# Altium schematic sheet Motor Driver.SchDoc
size A4; SheetNumber: 6; SheetTotal: 10
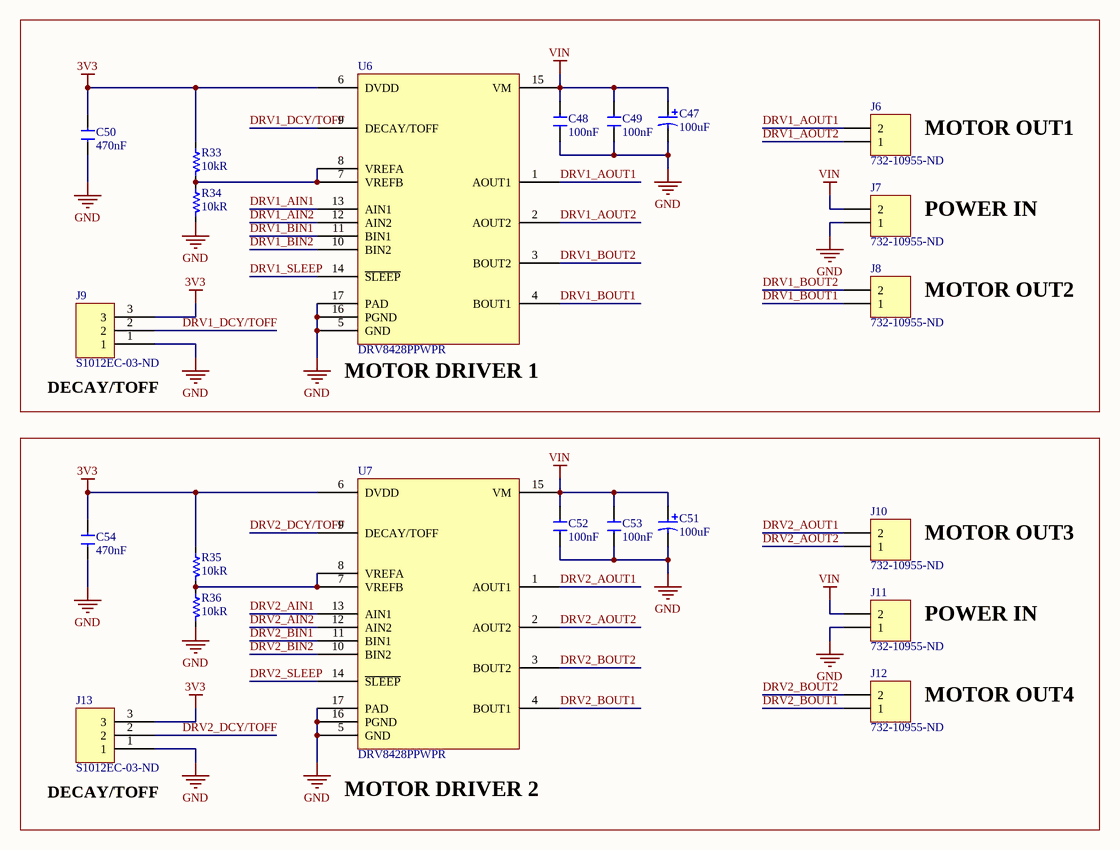
[diagram p0: Motor Driver.SchDoc]

## Parts
C47  Capacitance: 100uF  [RADIAL-2_6.3MMX7.7MM]  (hidden comment: CAP_100uF_%20_25V_ALUM_SMD)
C48  Capacitance: 100nF  [0805_CAP]  (hidden comment: CAP_0.1uF_50V_0805_X7R_CER)
C49  Capacitance: 100nF  [0805_CAP]  (hidden comment: CAP_0.1uF_50V_0805_X7R_CER)
C50  Capacitance: 470nF  [0805_CAP]  (hidden comment: CAP_0.47uF_%10_0805_25V_X7R_CER)
C51  Capacitance: 100uF  [RADIAL-2_6.3MMX7.7MM]  (hidden comment: CAP_100uF_%20_25V_ALUM_SMD)
C52  Capacitance: 100nF  [0805_CAP]  (hidden comment: CAP_0.1uF_50V_0805_X7R_CER)
C53  Capacitance: 100nF  [0805_CAP]  (hidden comment: CAP_0.1uF_50V_0805_X7R_CER)
C54  Capacitance: 470nF  [0805_CAP]  (hidden comment: CAP_0.47uF_%10_0805_25V_X7R_CER)
J6  Supplier Part Number 1: 732-10955-ND  [1x2_TERMINAL BLOCK]  (hidden comment: CONN_1X2_Terminal Block)
J7  Supplier Part Number 1: 732-10955-ND  [1x2_TERMINAL BLOCK]  (hidden comment: CONN_1X2_Terminal Block)
J8  Supplier Part Number 1: 732-10955-ND  [1x2_TERMINAL BLOCK]  (hidden comment: CONN_1X2_Terminal Block)
J9  Supplier Part Number 1: S1012EC-03-ND  [DIP_1X3_MALE_HEADER_2.54_PITCH]  (hidden comment: CONN_1X3_2.54mm_Male Header)
J10  Supplier Part Number 1: 732-10955-ND  [1x2_TERMINAL BLOCK]  (hidden comment: CONN_1X2_Terminal Block)
J11  Supplier Part Number 1: 732-10955-ND  [1x2_TERMINAL BLOCK]  (hidden comment: CONN_1X2_Terminal Block)
J12  Supplier Part Number 1: 732-10955-ND  [1x2_TERMINAL BLOCK]  (hidden comment: CONN_1X2_Terminal Block)
J13  Supplier Part Number 1: S1012EC-03-ND  [DIP_1X3_MALE_HEADER_2.54_PITCH]  (hidden comment: CONN_1X3_2.54mm_Male Header)
R33  Resistance: 10kR  [0805_RES]  (hidden comment: 10k Ohms)
R34  Resistance: 10kR  [0805_RES]  (hidden comment: 10k Ohms)
R35  Resistance: 10kR  [0805_RES]  (hidden comment: 10k Ohms)
R36  Resistance: 10kR  [0805_RES]  (hidden comment: 10k Ohms)
U6  DRV8428PPWPR  [TSOP65P640X120_HS-17N]
U7  DRV8428PPWPR  [TSOP65P640X120_HS-17N]

## Nets
3V3: C50.2 C54.2 J9.3 J13.3 R33.2 R35.2 U6.6(DVDD) U7.6(DVDD)
GND: C47.2 C48.1 C49.1 C50.1 C51.2 C52.1 C53.1 C54.1 J7.1 J9.1 J11.1 J13.1 R34.1 R36.1 U6.5(GND) U6.16(PGND) U6.17(PAD) U7.5(GND) U7.16(PGND) U7.17(PAD)
VIN: C47.1 C48.2 C49.2 C51.1 C52.2 C53.2 J7.2 J11.2 U6.15(VM) U7.15(VM)
DRV1_AIN1: U6.13(AIN1)
DRV1_AIN2: U6.12(AIN2)
DRV1_AOUT1: J6.2 U6.1(AOUT1)
DRV1_AOUT2: J6.1 U6.2(AOUT2)
DRV1_BIN1: U6.11(BIN1)
DRV1_BIN2: U6.10(BIN2)
DRV1_BOUT1: J8.1 U6.4(BOUT1)
DRV1_BOUT2: J8.2 U6.3(BOUT2)
DRV1_DCY/TOFF: J9.2 U6.9(DECAY/TOFF)
DRV1_SLEEP: U6.14(~{SLEEP})
DRV2_AIN1: U7.13(AIN1)
DRV2_AIN2: U7.12(AIN2)
DRV2_AOUT1: J10.2 U7.1(AOUT1)
DRV2_AOUT2: J10.1 U7.2(AOUT2)
DRV2_BIN1: U7.11(BIN1)
DRV2_BIN2: U7.10(BIN2)
DRV2_BOUT1: J12.1 U7.4(BOUT1)
DRV2_BOUT2: J12.2 U7.3(BOUT2)
DRV2_DCY/TOFF: J13.2 U7.9(DECAY/TOFF)
DRV2_SLEEP: U7.14(~{SLEEP})
NetR33_1: R33.1 R34.2 U6.7(VREFB) U6.8(VREFA)
NetR35_1: R35.1 R36.2 U7.7(VREFB) U7.8(VREFA)

## Notes on the sheet
- MOTOR OUT1
- POWER IN
- MOTOR OUT2
- (near J9) DECAY/TOFF
- (near U6) MOTOR DRIVER 1
- MOTOR OUT3
- MOTOR OUT4
- (near J13) DECAY/TOFF
- (near U7) MOTOR DRIVER 2

## Library data of the parts
C47 C51 = CAP_100uF_%20_25V_ALUM_SMD: CAP.EL.100uF 25V 6.3x7.7 105C 5000HRS SMD; Manufacturer: SAMYOUNG; Manufacturer Part Number: BLA25VC100MF80TP; Ripple Current: 230mA; Tolerance: 20%; Category: Aluminum Electrolytic Capacitors; Voltage Rating: 25V
C48 C49 C52 C53 = CAP_0.1uF_50V_0805_X7R_CER: Cap Ceramic 0.1uF 50V X7R 20% SMD 0805 125C Paper T/R; Manufacturer: KEMET; Manufacturer Part Number: C0805C104M5RACTU; Supplier 1: Digi-Key; RoHS: Yes; Category: Ceramic Capacitors; Stock 1: 4863; Pricing 1: 1=0,10000, 10=0,06400, 50=0,03500, 100=0,02860, 500=0,02040, 1000=0,01603 (USD); Mount: Surface Mount; Case/Package: 0805; Dielectric Material: Ceramic; Min Operating Temperature: -55°C; Max Operating Temperature: 125°C; Tolerance: 20%; Dielectric: X7R; Packaging: Tape and Reel; Voltage Rating (DC): 50V; Length: 2mm; Height: 0.9mm; Depth: 1.25mm; Radiation Hardening: No; ComponentLink1URL: http://uk.rs-online.com/webdocs/13da/0900766b813daa06.pdf?src-supplier=RSComponents; ComponentLink1Description: http://uk.rs-online.com/webdocs/13da/0900766b813daa06.pdf?src-supplier=RSComponents; ComponentLink2URL: https://www.verical.com/server-webapp/html/getDatasheet?partID=774625&src-supplier=Verical; ComponentLink2Description: https://www.verical.com/server-webapp/html/getDatasheet?partID=774625&src-supplier=Verical; ComponentLink3URL: http://www.farnell.com/datasheets/2739857.pdf?src-supplier=Farnell; ComponentLink3Description: http://www.farnell.com/datasheets/2739857.pdf?src-supplier=Farnell; ComponentLink4URL: http://uk.rs-online.com/webdocs/1515/0900766b81515223.pdf?src-supplier=RSComponents; ComponentLink4Description: http://uk.rs-online.com/webdocs/1515/0900766b81515223.pdf?src-supplier=RSComponents; ComponentLink5URL: http://components.arrow.com/part/dataview/0323_00324812?src-supplier=Arrow+Europe; ComponentLink5Description: http://components.arrow.com/part/dataview/0323_00324812?src-supplier=Arrow+Europe; ComponentLink6URL: http://uk.rs-online.com/webdocs/1528/0900766b81528e2f.pdf?src-supplier=RSComponents; ComponentLink6Description: http://uk.rs-online.com/webdocs/1528/0900766b81528e2f.pdf?src-supplier=RSComponents; ComponentLink7URL: http://www.farnell.com/datasheets/2739857.pdf?src-supplier=Newark; ComponentLink7Description: http://www.farnell.com/datasheets/2739857.pdf?src-supplier=Newark; ComponentLink8URL: http://www.alliedelec.com/m/d/9bfe7773041ffe9d406e68bc7b377fdd.pdf?src-supplier=Allied+Electronics; ComponentLink8Description: http://www.alliedelec.com/m/d/9bfe7773041ffe9d406e68bc7b377fdd.pdf?src-supplier=Allied+Electronics; ComponentLink9URL: https://api.kemet.com/component-edge/download/datasheet/C0805C104M5RACTU.pdf?src-supplier=Digi-Key; ComponentLink9Description: https://api.kemet.com/component-edge/download/datasheet/C0805C104M5RACTU.pdf?src-supplier=Digi-Key; ComponentLink10URL: http://capacitoredge.kemet.com/capedge2/DataSheet?pn=C0805C104M5RACTU&src-supplier=Avnet+Europe; ComponentLink10Description: http://capacitoredge.kemet.com/capedge2/DataSheet?pn=C0805C104M5RACTU&src-supplier=Avnet+Europe; ComponentLink11URL: http://www.farnell.com/datasheets/2739857.pdf?src-supplier=Element14; ComponentLink11Description: http://www.farnell.com/datasheets/2739857.pdf?src-supplier=Element14; ComponentLink12URL: http://www.mouser.com/ds/2/212/KEM_C1002_X7R_SMD-1102033.pdf?src-supplier=Mouser; ComponentLink12Description: http://www.mouser.com/ds/2/212/KEM_C1002_X7R_SMD-1102033.pdf?src-supplier=Mouser; ComponentLink13URL: https://www.verical.com/server-webapp/html/getDatasheet?partID=91523&src-supplier=Verical; ComponentLink13Description: https://www.verical.com/server-webapp/html/getDatasheet?partID=91523&src-supplier=Verical; ComponentLink14URL: http://components.arrow.com/part/dataview/2091108S8109171N7429?src-supplier=Arrow+Electronics; ComponentLink14Description: http://components.arrow.com/part/dataview/2091108S8109171N7429?src-supplier=Arrow+Electronics; Supplier Part Number 1: 399-C0805C104M5RAC7800CT-ND
C50 C54 = CAP_0.47uF_%10_0805_25V_X7R_CER: Cap Ceramic 0.47uF 25V X7R 10% SMD 0805 125°C Embossed Plastic T/R; Manufacturer: Samsung; Manufacturer Part Number: CL21B474KAFNNNG; Supplier 1: Digi-Key; RoHS: Yes; Category: Ceramic Capacitors; Stock 1: 869119; Pricing 1: 1=0,10000, 10=0,05100, 50=0,02800, 100=0,02290, 500=0,01632, 1000=0,01283 (USD); Mount: Surface Mount; Case/Package: 0805; Case Code (Metric): 2012; Case Code (Imperial): 0805; Material: Ceramic; Min Operating Temperature: -55°C; Max Operating Temperature: 125°C; Tolerance: 10%; Dielectric: X7R; Voltage: 25V; Voltage Rating: 25V; Package Quantity: 3000; Packaging: Tape and Reel; Series: CL; Length: 2mm; Width: 0.049inch; Height: 1.25mm; Depth: 1.25mm; Thickness: 0.053inch; Lead Free: Lead Free; RoHS Compliant: Yes; ComponentLink1URL: https://datasheet.ciiva.com/25733/cl21b474kafnnng-25733031.pdf?src-supplier=Digi-Key; ComponentLink1Description: https://datasheet.ciiva.com/25733/cl21b474kafnnng-25733031.pdf?src-supplier=Digi-Key; ComponentLink2URL: https://datasheet.ciiva.com/29200/453685-da-01-en-vs-kondensator-0805-29200035.pdf?src-supplier=Conrad; ComponentLink2Description: https://datasheet.ciiva.com/29200/453685-da-01-en-vs-kondensator-0805-29200035.pdf?src-supplier=Conrad; ComponentLink3URL: https://datasheet.ciiva.com/29200/453672-da-01-en-vs-kondensator-0805-29200028.pdf?src-supplier=Conrad; ComponentLink3Description: https://datasheet.ciiva.com/29200/453672-da-01-en-vs-kondensator-0805-29200028.pdf?src-supplier=Conrad; Supplier Part Number 1: 1276-6480-1-ND
J6-J8 J10-J12 = CONN_1X2_Terminal Block: Series 1377 - 5.00 mm Horizontal Entry with Pressure Clamp WR-TBL, 2 pin; Manufacturer: Wurth Electronics; Manufacturer Part Number: 691137710002; Plating: Copper Alloy; Number of Levels: 1; Number of Positions Per Level: 2; Current: 16A; Voltage: 300V; Wire Gauge (Max): 30AWG; Wire Gauge (Min): 12AWG; Supplier 1: Digi-Key; RoHS: No; Category: Terminal Blocks; Stock 1: 10587; Pricing 1: 1=0,39000, 10=0,35200, 50=0,31100, 100=0,27900, 500=0,26900 (USD); Mount: Through Hole; Color: Green; Housing Material: PC; Min Operating Temperature: -30°C; Max Operating Temperature: 120°C; Packaging: Bulk; Termination: Screw; ComponentLink1URL: https://katalog.we-online.de/em/datasheet/691137710002.pdf?src-supplier=Digi-Key; ComponentLink1Description: https://katalog.we-online.de/em/datasheet/691137710002.pdf?src-supplier=Digi-Key
J9 J13 = CONN_1X3_2.54mm_Male Header: Conn Header Vert 3POS 2.54MM; Manufacturer: Sullins; Manufacturer Part Number: PREC003SAAN-RC; Number of Positions: 3; Connector Type: Male Pin; Pitch: 0.1inch; Supplier 1: Digi-Key; RoHS: Yes; Category: Connectors; Stock 1: 15048; Pricing 1: 1=0,09000, 10=0,08400, 25=0,06240, 50=0,05340, 100=0,05170, 250=0,04456, 500=0,04276 (USD); Mount: Through Hole; Color: Black; Contact Plating: Tin; Package Quantity: 1; Number of Rows: 1; Packaging: Bulk; Termination: Solder; Series: -; Contact Type: Male Pin; Contact Mating Length: 0.23inch; RoHS Compliant: Yes; ComponentLink1URL: https://datasheet.ciiva.com/740/zrzczzzszzn-rc-st-11635-b-740842.pdf?src-supplier=Digi-Key; ComponentLink1Description: https://datasheet.ciiva.com/740/zrzczzzszzn-rc-st-11635-b-740842.pdf?src-supplier=Digi-Key
R33-R36 = RES_10K OHM_%1_0805_1/8W: Res SMD 0805 10K 1% 0.125W T.C.100PPM; Manufacturer: TDK; Manufacturer Part Number: C2012X7R1H104K085AA; Dielectric Material: Ceramic; Capacitance: 100nF; Tolerance: 10%; Dielectric: X7R; Voltage Rating: 50V; Temperature Coefficient: 100ppm/°C; Power Rating: 125mW; Supplier 1: Digi-Key; RoHS: Yes; Category: Ceramic Capacitors; Stock 1: 54853; Pricing 1: 1=0,15000, 10=0,10900, 50=0,06160, 100=0,05100, 500=0,03578, 1000=0,02962 (USD); Mount: Surface Mount; Case/Package: 0805; Number of Pins: 2; Case Code (Metric): 2012; Case Code (Imperial): 0805; Weight: 0.000194oz; Min Operating Temperature: -55°C; Max Operating Temperature: 125°C; Packaging: Tape and Reel; Voltage Rating (DC): 50V; Termination: SMD/SMT; Construction: Flat; Package Quantity: 1; Resistor Type: Ceramic; Voltage: 50V; Series: C; Length: 2mm; Width: 0.049inch; Height: 0.85mm; Depth: 1.25mm; Thickness: 0.037inch; Radiation Hardening: No; RoHS Compliant: Yes; REACH SVHC: No SVHC; Lead Free: Lead Free; ComponentLink1URL: https://datasheet.ciiva.com/11788/0900766b80c1bb00-11788128.pdf?src-supplier=RSComponents; ComponentLink1Description: https://datasheet.ciiva.com/11788/0900766b80c1bb00-11788128.pdf?src-supplier=RSComponents; ComponentLink2URL: https://datasheet.ciiva.com/6250/tdkmlcccaprange-6250821.pdf?src-supplier=Digi-Key; ComponentLink2Description: https://datasheet.ciiva.com/6250/tdkmlcccaprange-6250821.pdf?src-supplier=Digi-Key; ComponentLink3URL: https://datasheet.ciiva.com/24191/e412-c-24191447.pdf?src-supplier=Future+Electronics; ComponentLink3Description: https://datasheet.ciiva.com/24191/e412-c-24191447.pdf?src-supplier=Future+Electronics; ComponentLink4URL: https://datasheet.ciiva.com/6250/tdkmlcccaprange-6250824.pdf?src-supplier=Digi-Key; ComponentLink4Description: https://datasheet.ciiva.com/6250/tdkmlcccaprange-6250824.pdf?src-supplier=Digi-Key; ComponentLink5URL: https://datasheet.ciiva.com/23803/1796654-23803035.pdf?src-supplier=Newark; ComponentLink5Description: https://datasheet.ciiva.com/23803/1796654-23803035.pdf?src-supplier=Newark; ComponentLink6URL: https://datasheet.ciiva.com/28602/1571323-28602204.pdf?src-supplier=Element14; ComponentLink6Description: https://datasheet.ciiva.com/28602/1571323-28602204.pdf?src-supplier=Element14; Supplier Part Number 1: 445-7534-1-ND; Supplier 2: Digi-Key; Stock 2: 3512962; Pricing 2: 1=0,10000, 10=0,04200, 100=0,01690, 1000=0,00759, 2500=0,00659 (USD); Size Code: 0805; Number of Terminations: 2; Max Power Dissipation: 125mW; Features: Moisture Resistant; Resistance Tolerance: 1%; Technology: THICK FILM; Military Standard: Not; Supplier Part Number 2: 311-10.0KCRCT-ND
U6 U7 = IC_MOTOR DRIVER_DRV8428PPWPR: 35V, 1A bipolar stepper or dual brushed motor driver with integrated current sensing 16-HTSSOP -40 to 125; Manufacturer: Texas Instruments; Supplier 1: Digi-Key; Manufacturer Part Number: DRV8428PPWPR; RoHS: Yes; Category: Integrated Circuits (ICs); Stock 1: 2129; Pricing 1: 1=3,15000, 10=2,83100, 25=2,67600, 100=2,31920, 250=2,20024, 500=1,97428, 1000=1,96350 (USD); RoHS Compliant: Yes; Supplier Part Number 1: 296-DRV8428PPWPRCT-ND